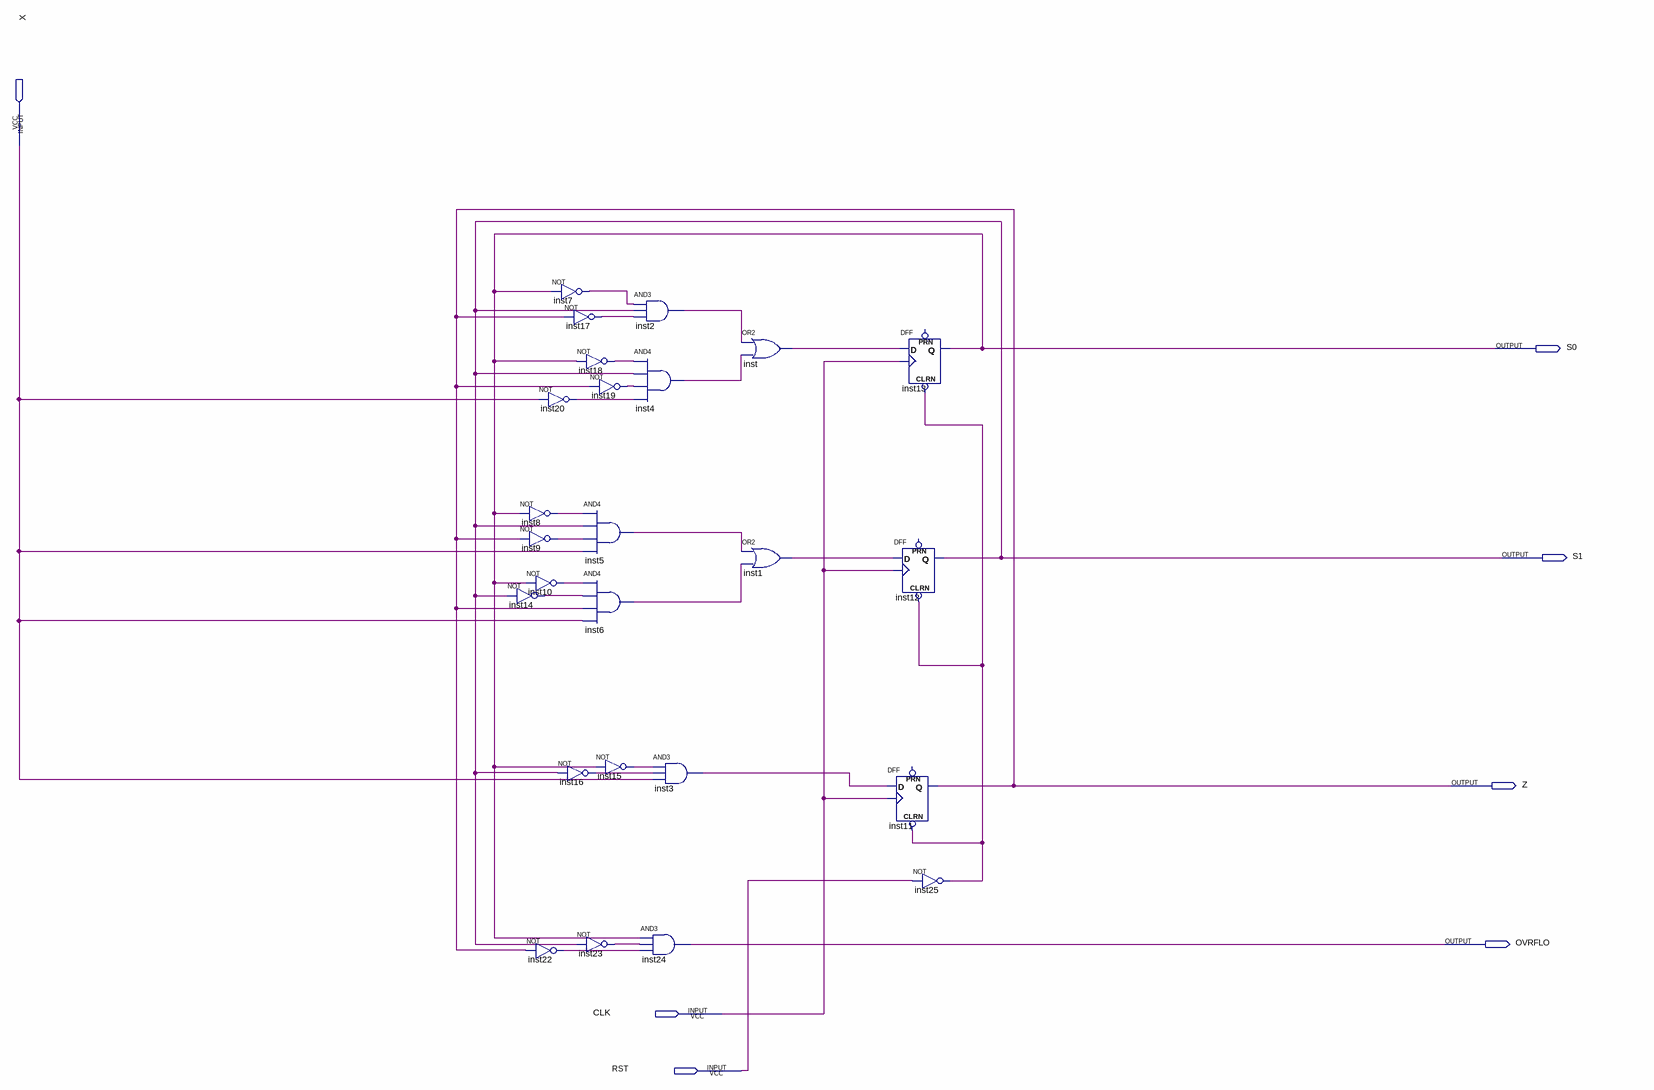
[diagram p0: schematic sheet]
// Quartus schematic sequence_vtwo.bdf as structural Verilog: 25 symbols, 7 pins
module sequence_vtwo (
  input  X,
  input  CLK,
  input  RST,
  output S0,
  output S1,
  output Z,
  output OVRFLO
);

  wire inst1_out, inst2_out, inst3_out, inst4_out, inst5_out, inst6_out, inst7_out, inst8_out, inst9_out,
       inst10_out, inst14_out, inst15_out, inst16_out, inst17_out, inst18_out, inst19_out, inst20_out,
       inst22_out, inst23_out, inst25_out, inst_out;

  not inst14 (inst14_out, S1);
  not inst7 (inst7_out, S0);
  not inst20 (inst20_out, X);
  not inst8 (inst8_out, S0);
  not inst9 (inst9_out, Z);
  not inst10 (inst10_out, S0);
  not inst16 (inst16_out, S1);
  not inst22 (inst22_out, Z);
  not inst17 (inst17_out, Z);
  not inst18 (inst18_out, S0);
  not inst19 (inst19_out, Z);
  and inst5 (inst5_out, inst8_out, S1, inst9_out, X);
  and inst6 (inst6_out, inst10_out, inst14_out, Z, X);
  not inst15 (inst15_out, S0);
  not inst23 (inst23_out, S1);
  and inst2 (inst2_out, inst7_out, S1, inst17_out);
  and inst4 (inst4_out, inst18_out, S1, inst19_out, inst20_out);
  and inst3 (inst3_out, inst15_out, inst16_out, X);
  and inst24 (OVRFLO, S0, inst23_out, inst22_out);
  or inst (inst_out, inst2_out, inst4_out);
  or inst1 (inst1_out, inst5_out, inst6_out);
  DFF inst13 (.CLRN(inst25_out), .CLK(CLK), .D(inst_out), .Q(S0));  // open: PRN
  DFF inst12 (.CLRN(inst25_out), .CLK(CLK), .D(inst1_out), .Q(S1));  // open: PRN
  DFF inst11 (.CLRN(inst25_out), .CLK(CLK), .D(inst3_out), .Q(Z));  // open: PRN
  not inst25 (inst25_out, RST);
endmodule
